# EAGLE design Whale_Lamp-jlc-v2 (EAGLE 8.3.1)
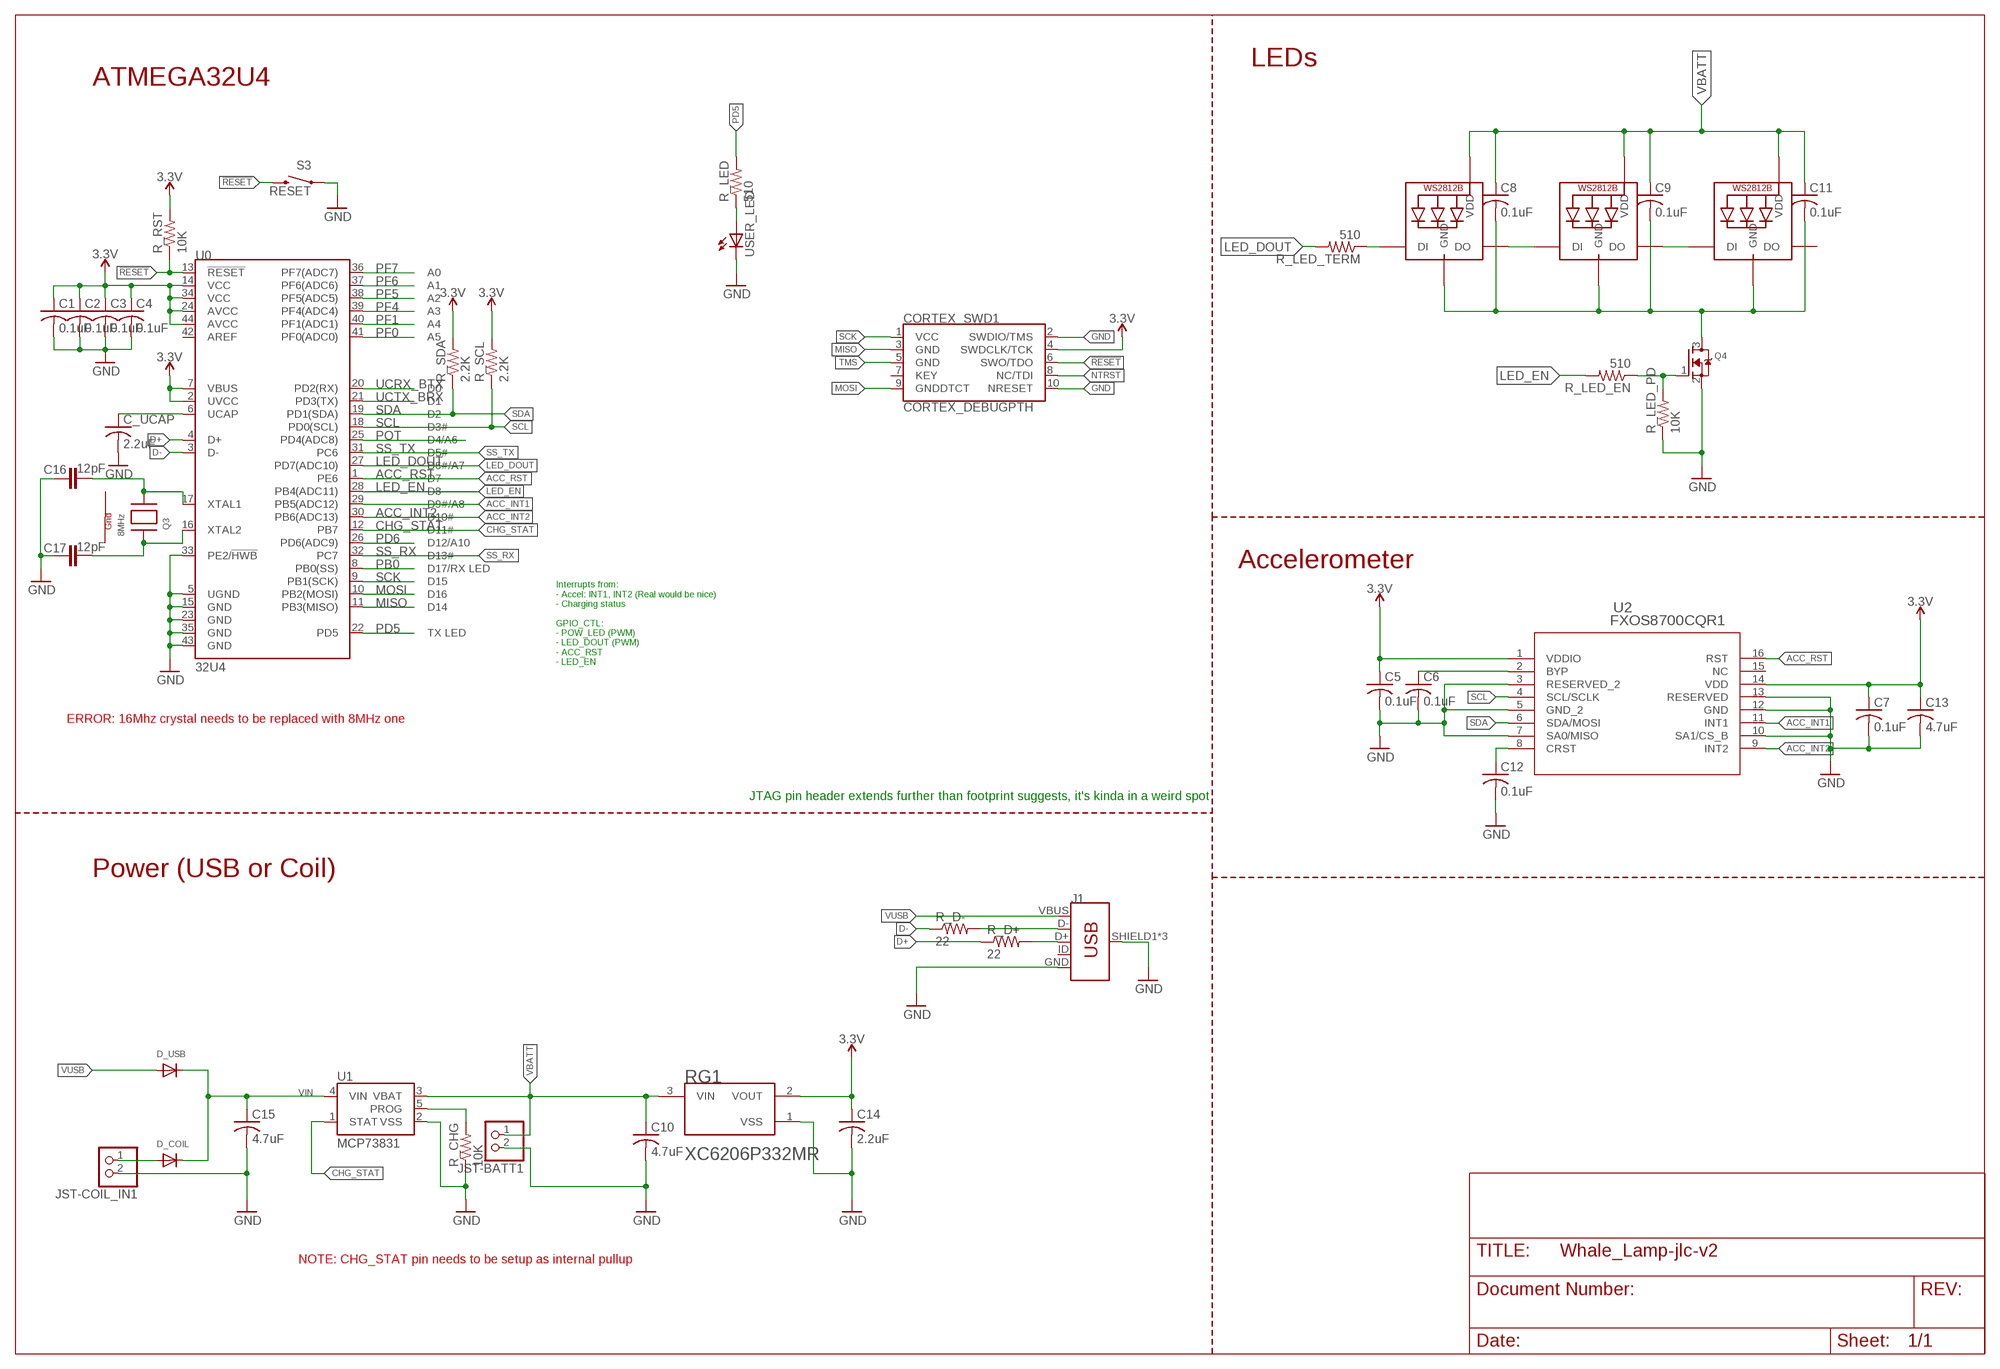
[diagram p0: schematic, sheet 1]

## Parts
C1  0.1uF  C-USC0402  [C0402]
C2  0.1uF  C-USC0402  [C0402]
C3  0.1uF  C-USC0402  [C0402]
C4  0.1uF  C-USC0402  [C0402]
C5  0.1uF  C-USC0402  [C0402]
C6  0.1uF  C-USC0402  [C0402]
C7  0.1uF  C-USC0402  [C0402]
C8  0.1uF  C-USC0402  [C0402]
C9  0.1uF  C-USC0402  [C0402]
C10  4.7uF  C-USC0603  [C0603]
C11  0.1uF  C-USC0402  [C0402]
C12  0.1uF  C-USC0402  [C0402]
C13  4.7uF  C-USC0603  [C0603]
C14  2.2uF  C-USC0603  [C0603]
C15  4.7uF  C-USC0603  [C0603]
C16  12pF  CAP0402-CAP  [0402-CAP]
C17  12pF  CAP0402-CAP  [0402-CAP]
C_UCAP  2.2uF  C-USC0603  [C0603]
CORTEX_SWD1  CORTEX_DEBUGPTH  [2X5-PTH-1.27MM]
D_COIL  DIODESOD-123  [SOD-123]
D_USB  DIODESOD-123  [SOD-123]
J1  USB_MICRO-B_FEMALE-SMT  [USB-B-MICRO-SMD]
JST-BATT1  JST_2PIN-THM-RA  [JST-PH-2-THM-RA]
JST-COIL_IN1  JST_2PIN-THM-RA  [JST-PH-2-THM-RA]
LED1  WS2812B3535  [LED3535]
LED2  WS2812B3535  [LED3535]
LED3  WS2812B3535  [LED3535]
Q3  8MHz  XTAL-4-3225  [NX3225]
Q4  MOSFET-NREFLOW  [SOT23]
R_CHG  10K  R-US_R0402  [R0402]
R_D+  22  R-US_R0402  [R0402]
R_D-  22  R-US_R0402  [R0402]
R_LED  510  R-US_R0402  [R0402]
R_LED_EN  510  R-US_R0402  [R0402]
R_LED_PD  10K  R-US_R0402  [R0402]
R_LED_TERM  510  R-US_R0402  [R0402]
R_RST  10K  R-US_R0402  [R0402]
R_SCL  2.2K  R-US_R0402  [R0402]
R_SDA  2.2K  R-US_R0402  [R0402]
RG1  TOREX_XC6206P332MRTOREX_XC6206P332MR_0_0  [TOREX_XC6206P332MR_0]
S3  RESET  SWITCH-MOMENTARY-2SMD-4.6X2.8MM  [TACTILE_SWITCH_SMD_4.6X2.8MM]
U0  32U4  ATMEGA32U4QFN  [QFN-44]
U1  MCP73831  [SOT23-5]
U2  FXOS8700CQR1  [QFN16_3X3_NXP]
USER_LED  LEDCHIPLED_0603  [CHIPLED_0603]

## Nets
3.3V: C1.1 C2.1 C3.1 C4.1 C5.1 C7.1 C13.1 C14.1 CORTEX_SWD1.4(SWDCLK/TCK) R_RST.2 R_SCL.2 R_SDA.2 RG1.2(VOUT) U0.2(UVCC) U0.7(VBUS) U0.14(VCC) U0.24(AVCC) U0.34(VCC) U0.44(AVCC) U2.1(VDDIO) U2.14(VDD)
!RESET: CORTEX_SWD1.6(SWO/TDO) R_RST.1 S3.3 S3.4 U0.13(!RESET)
ACC_INT1: U0.29(PB5(ADC12)) U2.11(INT1)
ACC_INT2: U0.30(PB6(ADC13)) U2.9(INT2)
ACC_RST: U0.1(PE6) U2.16(RST)
CHG_STAT: U0.12(PB7) U1.1(STAT)
D+: R_D+.1 U0.4(D+)
D-: R_D-.1 U0.3(D-)
GND: C1.2 C2.2 C3.2 C4.2 C5.2 C6.2 C7.2 C10.2 C12.2 C13.2 C14.2 C15.2 C16.1 C17.1 C_UCAP.2 CORTEX_SWD1.2(SWDIO/TMS) CORTEX_SWD1.10(NRESET) J1.GND J1.SHIELD1(SHIELD) J1.SHIELD2(SHIELD) J1.SHIELD3(SHIELD) JST-BATT1.2 JST-COIL_IN1.2 Q4.2(S) R_CHG.1 R_LED_PD.1 RG1.1(VSS) S3.1 S3.2 U0.5(UGND) U0.15(GND) U0.23(GND) U0.33(PE2/!HWB) U0.35(GND) U0.43(GND) U1.2(VSS) U2.3(RESERVED_2) U2.5(GND_2) U2.7(SA0/MISO) U2.10(SA1/CS_B) U2.12(GND) U2.13(RESERVED) USER_LED.C
LED_DOUT: R_LED_TERM.2 U0.27(PD7(ADC10))
LED_EN: R_LED_EN.2 U0.28(PB4(ADC11))
MISO: CORTEX_SWD1.3(GND) U0.11(PB3(MISO))
MOSI: CORTEX_SWD1.9(GNDDTCT) U0.10(PB2(MOSI))
N$6: J1.D- R_D-.2
N$7: R_CHG.2 U1.5(PROG)
N$8: R_LED.1 USER_LED.A
N$10: C16.2 Q3.3(X2) U0.17(XTAL1)
N$11: C17.2 Q3.1(X1) U0.16(XTAL2)
N$12: LED1.3(DO) LED2.1(DI)
N$13: LED2.3(DO) LED3.1(DI)
N$15: C8.2 C9.2 C11.2 LED1.4(GND) LED2.4(GND) LED3.4(GND) Q4.3(D)
N$16: LED1.1(DI) R_LED_TERM.1
N$17: Q4.1(G) R_LED_EN.1 R_LED_PD.2
N$18: C12.1 U2.8(CRST)
N$19: C6.1 U2.2(BYP)
N$21: C_UCAP.1 U0.6(UCAP)
N$23: J1.D+ R_D+.2
N$25: D_COIL.A JST-COIL_IN1.1
NTRST: CORTEX_SWD1.8(NC/TDI)
PB0: U0.8(PB0(SS))
PD5: R_LED.2 U0.22(PD5)
PD6: U0.26(PD6(ADC9))
PF0: U0.41(PF0(ADC0))
PF1: U0.40(PF1(ADC1))
PF4: U0.39(PF4(ADC4))
PF5: U0.38(PF5(ADC5))
PF6: U0.37(PF6(ADC6))
PF7: U0.36(PF7(ADC7))
POT: U0.25(PD4(ADC8))
SCK: CORTEX_SWD1.1(VCC) U0.9(PB1(SCK))
SCL: R_SCL.1 U0.18(PD0(SCL)) U2.4(SCL/SCLK)
SDA: R_SDA.1 U0.19(PD1(SDA)) U2.6(SDA/MOSI)
SS_RX: U0.32(PC7)
SS_TX: U0.31(PC6)
TMS: CORTEX_SWD1.5(GND)
UCRX_BTX: U0.20(PD2(RX))
UCTX_BRX: U0.21(PD3(TX))
VBATT: C8.1 C9.1 C10.1 C11.1 JST-BATT1.1 LED1.2(VDD) LED2.2(VDD) LED3.2(VDD) RG1.3(VIN) U1.3(VBAT)
VIN: C15.1 D_COIL.C D_USB.C U1.4(VIN)
VUSB: D_USB.A J1.VBUS
Unconnected: CORTEX_SWD1.7(KEY) J1.ID LED3.3(DO) U0.42(AREF) U2.15(NC)

## Notes on the sheet
- ATMEGA32U4 | LEDs
- Accelerometer
- Interrupts from:
  - Accel: INT1, INT2 (Real would be nice)
  - Charging status
  
  GPIO_CTL:
  - POW_LED (PWM)
  - LED_DOUT (PWM)
  - ACC_RST 
  - LED_EN
- ERROR: 16Mhz crystal needs to be replaced with 8MHz one
- JTAG pin header extends further than footprint suggests, it's kinda in a weird spot
- Power (USB or Coil)
- NOTE: CHG_STAT pin needs to be setup as internal pullup

## Power pins joined to a net without a drawn wire
G1: Q3.4(G1)
G2: Q3.2(G2)

## Library data of the parts
C1-C15 C_UCAP = adafruit:C-US: CAPACITOR, American symbol
C16 C17 = SparkFun:CAP: Capacitor Standard 0603 ceramic capacitor, and 0.1" leaded capacitor.
CORTEX_SWD1 = samd21-temp:CORTEX_DEBUG: Cortex Debug Connector Datasheet <http://infocenter.arm.com/help/topic/com.arm.doc.faqs/attached/13634/cortex_debug_connectors.pdf>
D_COIL D_USB = adafruit:DIODE: Diode SMADIODE - SMA Surface Mount Package 20V 1A Schottky Diode Digikey: 641-1014-6-ND DO-1N4148 - Through Hole Small Current Diode SOD-123 20V 1 A (.5mV Vf) Schottky Diode - Digikey: MBRX120TPMSCT-ND SOD-323 10V 570mA (.38mV Vf, 3ns) Schottky Diode - Digikey: ZLLS410CT-ND SOD-523 30V 30mA Schottky Diode (RB751S-40TE61) - Digikey: RB751S-40TE61CT-ND SOT23-R/W - SOT23 Package (R = Solder Paste/Reflow Ovens, W = Hand-Soldering) BAT54Film 40V 300mA - Digikey: 497-7162-1-ND
J1 = SparkFun-Connectors:USB_MICRO-B: USB Type Micro-B Connector Male/female and PTH/SMT variants SparkFun Products: SparkFun microB USB Breakout <https://www.sparkfun.com/products/12035> SparkFun USB microB Plug Breakout <https://www.sparkfun.com/products/10031> SparkFun ESP8266 Thing <https://www.sparkfun.com/products/13231>; PROD_ID: CONN-11752
JST-BATT1 JST-COIL_IN1 = adafruit:JST_2PIN: JST 2-Pin Connectors of various flavors SMT-RA (S2B-PH-SM4) 4UConnector #17311 SMT (B2B-PH-SM4) THM-RA (S2B-PH) THM (B2B-PH)
LED1-LED3 = adafruit:WS2812B
Q3 = adafruit:XTAL-4: Classic 4-pin 3.2 x 2.5mm crystal
Q4 = adafruit:MOSFET-N: N-Channel Mosfet 2N7002E - 60V 260mA SOT23 [Digikey: 2N7002ET1GOSTR-ND] - REEL BSH103 - 30V 850mA SOT23 [Digikey: 568-5013-1-ND]
R_CHG R_D+ R_D- R_LED R_LED_EN R_LED_PD R_LED_TERM R_RST R_SCL R_SDA = adafruit:R-US_: RESISTOR, American symbol
RG1 = Torex - XC6206P332MR:TOREX_XC6206P332MR: Low ESR Cap Compatible Positive Voltage Regulator; ACCURACY: ±2%; CENTROID_NOT_SPECIFIED: No; DATASHEET: https://www.torexsemi.com/file/xc6206/XC6206.pdf; DROPOUT_VOLTAGE: 250mV; IMPORTED_FROM: octopart; IPC_LAND_PATTERN_NAME: SOT95P280X110-3; LEAD_FREE: yes; MAXIMUM_OUTPUT_CURRENT: 200mA; MF: Torex; MFG_PACKAGE_IDENT: https://www.torexsemi.com/file/SOT-23/SOT-23-pkg.pdf; MOUSER_PART_NUMBER: 865-XC6206P332MR-G; MPN: XC6206P332MR; NUM_PINS: 3; OCTOPART_PART_NUMBER: e32b2b70e2ce3cec; PACKAGE: SOT23; PREFIX: RG; ROHS: yes; TEMPERATURE_RANGE_HIGH: +85°C; TEMPERATURE_RANGE_LOW: -40°C; VOLTAGE: 3.3V
S3 = samd21-temp:SWITCH-MOMENTARY-2: Various NO switches- pushbuttons, reed, etc; PROD_ID: SWCH-13065
U0 = SparkFun-IC-Microcontroller:ATMEGA32U4: Atmel MCU, 32KByte Atmel 44-pin 8-bit Microcontroller with 32KBytes of ISP Flash and USB Controller Datasheet <http://cdn.sparkfun.com/datasheets/Dev/Arduino/Boards/ATMega32U4.pdf> SparkFun Products LilyPad Arduino USB - ATmega32U4 Board <https://www.sparkfun.com/products/12049> (DEV-12049) Pro Micro - 5V/16MHz <https://www.sparkfun.com/products/12640> (DEV-12640) Pro Micro - 3.3V/8MHz <https://www.sparkfun.com/products/12587> (DEV-12587) Fio v3 - ATmega32U4 <https://www.sparkfun.com/products/11520> (DEV-11520) Qduino Mini <https://www.sparkfun.com/products/13614> (DEV-13614) Makey Makey - Standard Kit <https://www.sparkfun.com/products/11511> (WIG-11511) Makey Makey Deluxe Kit <https://www.sparkfun.com/products/11519> (WIG-11519); PROD_ID: IC-10828
U1 = SparkFun-IC-Power:MCP73831: MCP73831T Li-Ion, Li-Pol Controller Miniature single cell, fully integrated Li-Ion, Li-polymer charge management controller Datasheet <http://ww1.microchip.com/downloads/en/DeviceDoc/20001984g.pdf> SparkFun Products: SparkFun ESP32 Thing <https://www.sparkfun.com/products/13907> SparkFun 9DoF Razor IMU M0 <https://www.sparkfun.com/products/14001>; PROD_ID: IC-09995
U2 = FXOS8700CQR1:FXOS8700CQR1; BUILT_BY: EMA_Jessica; COPYRIGHT: Copyright (C) 2018 Accelerated Designs. All rights reserved; MANUFACTURER_PART_NUMBER: FXOS8700CQR1; SOURCELIBRARY: NXP_2019-12-31; VENDOR: NXP
USER_LED = adafruit:LED: LED OSRAM: - CHIPLED LG R971, LG N971, LY N971, LG Q971, LY Q971, LO R971, LY R971 LH N974, LH R974 LS Q976, LO Q976, LY Q976 LO Q996 - Hyper CHIPLED LW Q18S LB Q993, LB Q99A, LB R99A - SideLED LS A670, LO A670, LY A670, LG A670, LP A670 LB A673, LV A673, LT A673, LW A673 LH A674 LY A675 LS A676, LA A676, LO A676, LY A676, LW A676 LS A679, LY A679, LG A679 - Hyper Micro SIDELED® LS Y876, LA Y876, LO Y876, LY Y876 LT Y87S - SmartLED LW L88C, LW L88S LB L89C, LB L89S, LG L890 LS L89K, LO L89K, LY L89K LS L896, LA L896, LO L896, LY L896 - TOPLED LS T670, LO T670, LY T670, LG T670, LP T670 LSG T670, LSP T670, LSY T670, LOP T670, LYG T670 LG T671, LOG T671, LSG T671 LB T673, LV T673, LT T673, LW T673 LH T674 LS T676, LA T676, LO T676, LY T676, LB T676, LH T676, LSB T676, LW T676 LB T67C, LV T67C, LT T67C, LS T67K, LO T67K, LY T67K, LW E67C LS E67B, LA E67B, LO E67B, LY E67B, LB E67C, LV E67C, LT E67C LW T67C LS T679, LY T679, LG T679 LS T770, LO T770, LY T770, LG T770, LP T770 LB T773, LV T773, LT T773, LW T773 LH T774 LS E675, LA E675, LY E675, LS T675 LS T776, LA T776, LO T776, LY T776, LB T776 LHGB T686 LT T68C, LB T68C - Hyper Mini TOPLED® LB M676 - Mini TOPLED Santana® LG M470 LS M47K, LO M47K, LY M47K Source: http://www.osram.convergy.de/

## Board
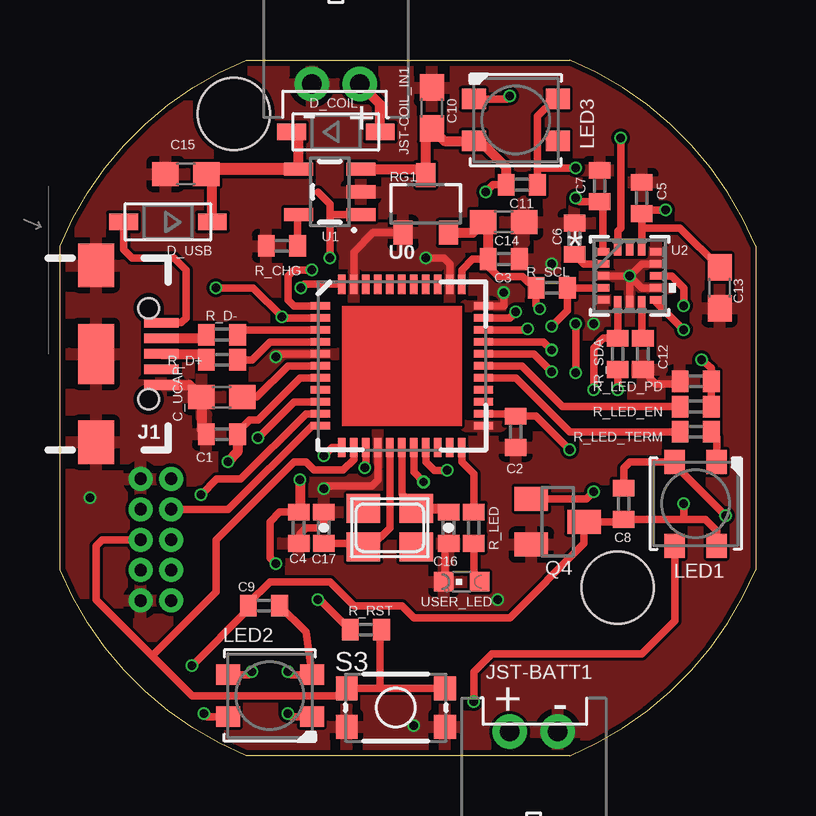
[diagram p1: board, top side]
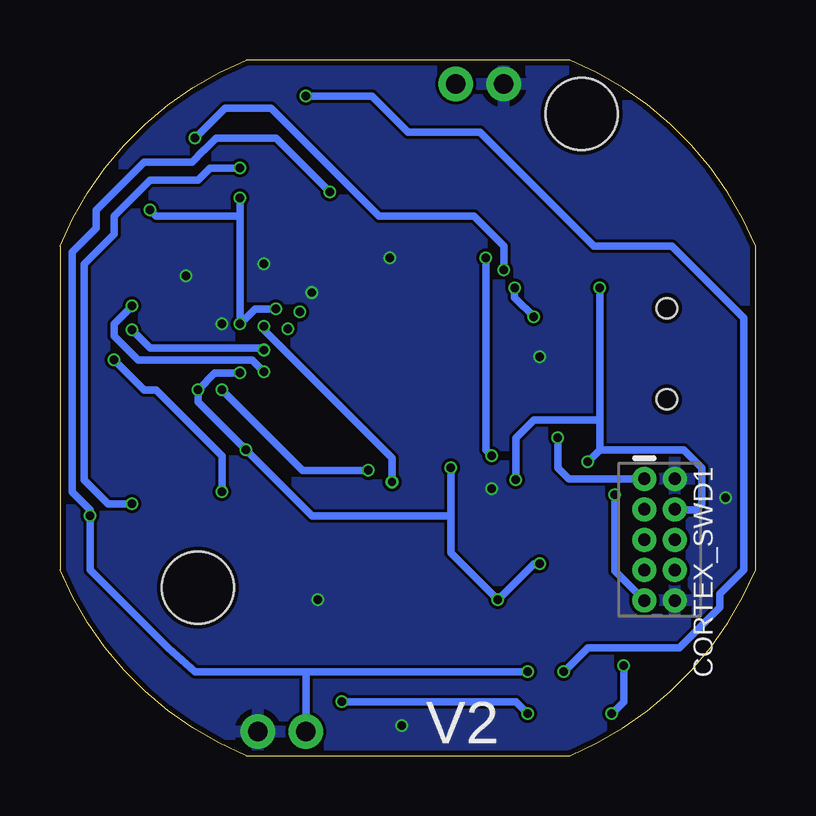
[diagram p2: board, bottom side, seen from below]

Size 29 x 29 mm. Coordinates in mm from the lower left corner, seen from the top.
Outline: 7.75,29 21.25,29 arc-45 29,21.25 29,7.75 arc-45 21.25,0 7.75,0 arc-45 0,7.75 0,21.25 arc-45 7.75,29
Copper layers (1*16): Top 0.035559375mm / dielectric 1.6mm / Bottom 0.035559375mm
Design rules "jlcpcb2layer": minimum track width 5mil, minimum drill 12mil, track to track 5mil, track to pad 5mil, pad to pad 5mil, via to via 5mil, smd to smd 5mil, copper to edge 8mil, drill to drill 6mil, minimum pad ring 5mil, minimum via ring 3mil, stop-mask expansion 2.5mil, vias tented up to drill 0mil, thermal gap 10mil
Holes 3 mm at 23.25,7 7.25,26.75

### Footprints (pad centres in the part's own frame; a part is rotated, then mirrored left to right if it is on the bottom)
C0402 = smd 0.7 x 0.9: 1 -0.65,0; 2 0.65,0
C0603 = smd 1.1 x 1: 1 -0.85,0; 2 0.85,0
0402-CAP = smd 0.7 x 0.9: 1 -0.65,0; 2 0.65,0
2X5-PTH-1.27MM = drill 0.508 pad 1: 1 -2.54,-0.635; 2 -2.54,0.635; 3 -1.27,-0.635; 4 -1.27,0.635; 5 0,-0.635; 6 0,0.635; 7 1.27,-0.635; 8 1.27,0.635; 9 2.54,-0.635; 10 2.54,0.635
SOD-123 = smd 1.2 x 0.7: A 1.85,0; C -1.85,0
USB-B-MICRO-SMD = smd 1.45 x 0.4: D+ 2.725,0; D- 2.725,0.65; GND 2.725,-1.3; ID 2.725,-0.65; VBUS 2.725,1.3 | smd 1.5 x 1.8: SHIELD1 0,3.685; SHIELD2 0,-3.685 | smd 1.5 x 2.5: SHIELD3 0,0 | hole 0.85: 2.2,1.9; 2.2,-1.9
JST-PH-2-THM-RA = drill 0.8 pad 1.422: 1 1,0; 2 -1,0
LED3535 = smd 1 x 0.85: 1 -1.75,0.875; 2 -1.75,-0.875; 3 1.75,-0.875; 4 1.75,0.875
NX3225 = smd 1.4 x 1.2: 1 -1.1,-0.8; 2 1.1,-0.8; 3 1.1,0.8; 4 -1.1,0.8
SOT23 = smd 1 x 1.4: 1 -0.95,-1.1; 2 0.95,-1.1; 3 0,1.1
R0402 = smd 0.7 x 0.9: 1 -0.65,0; 2 0.65,0
TOREX_XC6206P332MR_0 = smd 1 x 0.8: 1 -1.2,0.95; 2 -1.2,-0.95; 3 1.2,0
TACTILE_SWITCH_SMD_4.6X2.8MM = smd 0.9 x 1: 1 -2.05,-0.8; 2 2.05,-0.8; 3 2.05,0.8; 4 -2.05,0.8
QFN-44 = smd 0.8 x 0.3: 1 -3.4,2.5; 2 -3.4,2; 3 -3.4,1.5; 4 -3.4,1; 5 -3.4,0.5; 6 -3.4,0; 7 -3.4,-0.5; 8 -3.4,-1; 9 -3.4,-1.5; 10 -3.4,-2; 11 -3.4,-2.5; 23 3.4,-2.5; 24 3.4,-2; 25 3.4,-1.5; 26 3.4,-1; 27 3.4,-0.5; 28 3.4,0; 29 3.4,0.5; 30 3.4,1; 31 3.4,1.5; 32 3.4,2; 33 3.4,2.5 | smd 0.3 x 0.8: 12 -2.5,-3.4; 13 -2,-3.4; 14 -1.5,-3.4; 15 -1,-3.4; 16 -0.5,-3.4; 17 0,-3.4; 18 0.5,-3.4; 19 1,-3.4; 20 1.5,-3.4; 21 2,-3.4; 22 2.5,-3.4; 34 2.5,3.4; 35 2,3.4; 36 1.5,3.4; 37 1,3.4; 38 0.5,3.4; 39 0,3.4; 40 -0.5,3.4; 41 -1,3.4; 42 -1.5,3.4; 43 -2,3.4; 44 -2.5,3.4
SOT23-5 = smd 0.55 x 1.2: 1 -0.95,-1.3; 2 0,-1.3; 3 0.95,-1.3; 4 0.95,1.3; 5 -0.95,1.3
QFN16_3X3_NXP = smd 0.559 x 0.305: 1 -1.118,1; 2 -1.118,0.5; 3 -1.118,0; 4 -1.118,-0.5; 5 -1.118,-1; 9 1.118,-1; 10 1.118,-0.5; 11 1.118,0; 12 1.118,0.5; 13 1.118,1 | smd 0.305 x 0.559: 6 -0.5,-1.118; 7 0,-1.118; 8 0.5,-1.118; 14 0.5,1.118; 15 0,1.118; 16 -0.5,1.118
CHIPLED_0603 = smd 0.8 x 0.8: A 0,-0.75; C 0,0.75

### Placement (x,y rotation side)
C1  6.75,13.4 180 top
C2  19,13.5 270 top
C3  18.5,20.7 0 top
C4  9.95,9.5 270 top
C5  24.25,23.25 90 top
C6  21.45,21.55 90 top
C7  22.5,23.75 90 top
C8  23.5,10.5 270 top
C9  8.5,6.25 180 top
C10  15.5,27 90 top
C11  19.25,23.8 0 top
C12  24.3,16.75 270 top
C13  27.5,19.5 270 top
C14  18.5,22.25 0 top
C15  5.25,24.25 180 top
C16  16.2,9.5 90 top
C17  11,9.5 270 top
C_UCAP  6.75,14.95 180 top
CORTEX_SWD1  4,9 270 bottom
D_COIL  11.5,26 0 top
D_USB  4.5,22.25 180 top
J1  1.5,16.75 0 top
JST-BATT1  19.75,1 180 top
JST-COIL_IN1  11.5,28 0 top
LED1  26.5,10.5 270 top
LED2  8.75,2.5 180 top
LED3  19,26.5 0 top
Q3  13.75,9.5 0 top
Q4  20.75,9.75 270 top
R_CHG  9.25,21.25 0 top
R_D+  6.75,16.5 180 top
R_D-  6.75,17.55 180 top
R_LED  17.25,9.5 90 top
R_LED_EN  26.5,14.55 180 top
R_LED_PD  26.5,15.6 0 top
R_LED_TERM  26.5,13.5 180 top
R_RST  12.75,5.25 180 top
R_SCL  20.5,19.5 180 top
R_SDA  23.25,16.75 270 top
RG1  15.25,23 90 top
S3  14,2 0 top
U0  14.25,16.25 0 top
U1  11.25,23.5 90 top
U2  23.75,20 0 top
USER_LED  16.75,7.25 90 top

### Tracks (layer width: path | path; a pad name or v marks a point on that pad's centre or on a via)
3.3V  (via drill 0.35)
  Top 0.305: U0.24 18.9,14.25 C2.1 19.85,14.15 v21.25,12.75 | U2.14 24.25,22 | 24.25,22 C5.1 24.4,22.75 v25.25,22.75 | U2.1 22.63,22.97 C7.1 21.65,23.1 v21.5,23.25 | 24.25,22 25.85,22 C13.1 | U0.7 10,15.75 8.25,14 7.9,14 7.4,13.5 C1.1 | C4.1 9.93,10.15 9.15,10.15 8.75,9.75 8.75,8.25 v9,8 | v10.75,6.5 10.85,6.5 R_RST.2 | U0.2 9.29,18.25 v9.25,18.29 | U0.44 10.19,19.65 v10.04,19.5 | U0.14 12.75,12.04 v12.71,12 | R_SDA.2 v23.25,15.25 | v20,18.62 19.85,18.77 R_SCL.2 19.6,19.75 19.5,19.75 19.28,19.97 18.28,19.97 17.85,20.4 C3.1 17.2,20.7 16.75,20.25 U0.34 | v21.5,18 v21.5,15.96 | v9.25,18.29 9.21,18.29 | v6.5,19.5 8.04,19.5 v9.25,18.29
  Top 0.406: RG1.2 17.2,21.8 C14.1 17.85,22.05 C3.1 | v10,11.5 10,10.22 9.93,10.15 | C1.1 7.4,12.65 v7,12.25
  Bottom 0.305: 6.5,12.75 3,12.75 2.25,12 2.25,10.5 2.5,10.25 3.35,10.25 CORTEX_SWD1.4 | v7,12.25 6.5,12.75 | v10,11.5 10,13.25 9.25,14 6.51,14 6.5,14.01 | v9,8 9.25,8 v10.75,6.5 12.71,8.46 12.71,10 | v10.04,19.5 10.04,19.08 v9.25,18.29 | v12.71,12 12.71,10 | v20,18.62 20.88,18.62 v21.5,18 21.5,22.5 | v21.5,15.96 22.54,15.96 v23.25,15.25 23.25,14.75 v21.25,12.75 18.5,10 12.71,10 | v21.5,23.25 21.5,22.5 | 21.5,22.5 25,22.5 v25.25,22.75 | 6.5,14.01 v6.5,19.5 | 6.5,14.01 6.5,12.75
!RESET
  Top 0.305: 13.3,2.8 S3.3 | 13.3,2.8 S3.4 11.65,2.5 5.5,2.5 3.84,4.16 | 13.3,2.8 13.35,2.85 13.35,5.2 R_RST.1 | 3.84,4.16 1.5,6.5 1.5,8.75 1.75,9 CORTEX_SWD1.6 | 3.84,4.16 6.5,6.82 6.5,9 9.75,12.25 10.25,12.25 10.6,11.9 11.8,11.9 12.25,12.35 U0.13
ACC_INT1  (via drill 0.35)
  Top 0.305: U2.11 25.5,20 26,19.5 v26,18.75 | U0.29 19.75,16.75 v20.5,16
  Bottom 0.305: v26,18.75 26.75,18 26.75,17.5 25.75,16.5 21,16.5 v20.5,16
ACC_INT2  (via drill 0.35)
  Top 0.305: U2.9 24.87,18.88 v26,17.75 | U0.30 20.16,17.25 v20.5,16.91
  Bottom 0.305: v20.5,16.91 20.59,17 25.25,17 v26,17.75
ACC_RST  (via drill 0.35)
  Top 0.305: U0.1 9.75,18.75 9.5,19 9.5,20 9.75,20.25 v10.5,20.25 | U2.16 23.25,21.88 23.38,22 v23.38,25.75
  Bottom 0.305: v10.5,20.25 10.5,21.25 11.75,22.5 15.7,22.5 20.2,27 22.12,27 v23.38,25.75
CHG_STAT  (via drill 0.35)
  Top 0.305: 12.19,22.55 U1.1 | 12.5,22.5 U1.1 | 11.25,22.49 v11.25,20.75 | 11.25,22.49 11.25,23 10.75,23.5 | U1.1 11.31,22.55 11.25,22.49 | U0.12 11.35,12.85 v11,12.5
  Bottom 0.305: v11.25,20.75 11.25,12.75 v11,12.5
D+
  Top 0.305: U0.4 8.75,17.25 8,16.5 R_D+.1
D-
  Top 0.305: R_D-.1 7.6,17.75 U0.3
GND  (via drill 0.35)
  Top 0.305: U2.12 24.25,20.5 v23.75,20 | U0.5 9.12,16.75 v9,16.62 | U2.3 v23.75,20 | U2.7 v23.75,20 | U0.35 16.25,20.5 16,20.75 v15.25,20.75 | U0.33 18.5,18.75 v18.5,19.3 | C4.2 10,9.25 10.25,9.5 10.75,9.5 11,9.75 C17.1 | RG1.1 13.05,21.8 12.25,21 U0.43 | 25.7,15.5 R_LED_PD.1 25.75,15.5 24.85,15.5 24.3,16.05 C12.2 | U2.10 24.25,19.5 v23.75,20 | U0.15 13.25,11.5 13,11.25 11.12,11.25 v11,11.12 | 16.05,8.7 16.05,7.3 USER_LED.C
  Top 0.406: C1.2 5.9,13.6 C_UCAP.2 5.4,15.45 J1.GND | C16.1 16.05,8.7
  other vias: 14.75,1.25 18.25,6.5 22.25,18 1.25,10.75 20.5,20.5
  pour Top: -8.5,39.5 44,39.5 44,-11 -8.5,-11
  pour Bottom: -12,46 49,46 49,-16.5 -12,-16.5
LED_DOUT
  Top 0.305: U0.27 19,15.75 21.25,13.5 R_LED_TERM.2
LED_EN
  Top 0.305: U0.28 19.25,16.25 20.95,14.55 R_LED_EN.2
MISO
  Top 0.305: U0.11 10.5,13.75 7.02,10.27 CORTEX_SWD1.3
MOSI  (via drill 0.35)
  Top 0.305: U0.10 10.25,14.25 7.54,11.54 6.54,11.54 v5.88,10.88
  Bottom 0.305: v5.88,10.88 5.88,7.7 CORTEX_SWD1.9
N$6
  Top 0.406: J1.D- 5.95,17.4 R_D-.2
N$7
  Top 0.305: R_CHG.2 9.9,22.5 U1.5
N$8
  Top 0.305: R_LED.1 17.25,7.5 USER_LED.A
N$10
  Top 0.305: U0.17 14.25,10.9 Q3.3
  Top 0.406: Q3.3 16.05,10.3 C16.2
N$11
  Top 0.305: U0.16 13.75,9.5 12.95,8.7 Q3.1 12.5,8.85 C17.2
N$12  (via drill 0.35)
  Top 0.305: LED2.1 9.62,1.62 v9.5,1.75 | LED1.3 25.62,5.62 24.25,4.25 18,4.25 17.25,3.5 v17.25,2.25
  Bottom 0.305: v17.25,2.25 10,2.25 v9.5,1.75
N$13  (via drill 0.35)
  Top 0.305: LED2.3 7.88,3.38 v8,3.5 | LED3.1 18.62,27.38 v18.75,27.5
  Bottom 0.305: v18.75,27.5 16,27.5 14.5,26 11.5,26 6.75,21.25 3.5,21.25 0.5,18.25 0.5,7.75 1.5,6.75 1.5,6.18 3.18,4.5 7,4.5 v8,3.5
N$15  (via drill 0.35)
  Top 0.305: 26.02,9.85 26.9,9.85 27.38,9.38 LED1.4 | 26.02,9.85 C8.2 23.4,9.75 Q4.3 21.85,8.85 18.75,5.75 14.75,5.75 14.25,6.25 12.25,6.25 11.25,7.25 8.75,7.25 7.85,6.35 C9.2 7.85,6.1 v5.5,3.75 | LED2.4 6.12,1.62 v6,1.75 | LED3.4 20.62,27.38 19.9,26.65 19.9,24.49 | 19.9,24.49 C11.2 | v26,10.5 26,9.87 26.02,9.85 | v21.5,24.5 19.91,24.5 19.9,24.49
  Bottom 0.305: v26,10.5 27,10.5 28,11.5 28,20.5 26.75,21.75 26.75,22.5 25.25,24 23.25,24 22.75,24.5 v21.5,24.5 | v5.5,3.75 5.5,2.25 v6,1.75
N$16
  Top 0.305: LED1.1 27.38,13.28 R_LED_TERM.1
N$17  (via drill 0.35)
  Top 0.305: R_LED_EN.1 R_LED_PD.2 27.15,16.15 v26.75,16.5 | Q4.1 21.95,10.7 v22.25,11
  Bottom 0.305: v22.25,11 22.25,12.5 25,15.25 25.5,15.25 v26.75,16.5
N$18
  Top 0.305: U2.8 24.25,17.45 C12.1
N$19
  Top 0.305: U2.2 21.85,20.5 C6.1
N$21
  Top 0.305: U0.6 9.5,16.25 8.2,14.95 C_UCAP.1
N$23
  Top 0.406: J1.D+ 5.85,16.75 R_D+.2
N$25
  Top 0.406: D_COIL.A 13.35,27.15 JST-COIL_IN1.1
PD5
  Top 0.305: R_LED.2 17.25,11.75 16.75,12.25 U0.22
SCK  (via drill 0.35)
  Top 0.305: U0.9 9.75,14.75 v8.25,13.25
  Bottom 0.305: CORTEX_SWD1.1 7.79,11.54 8.25,12 v8.25,13.25
SCL  (via drill 0.35)
  Top 0.305: U2.4 R_SCL.1 21.15,18.55 v20.5,17.9 | U0.18 14.75,11.81 v15.16,11.4
  Bottom 0.305: v20.5,17.9 20.5,17.75 15.16,12.41 v15.16,11.4
SDA  (via drill 0.35)
  Top 0.305: U2.6 R_SDA.1 22.65,17.4 22.25,17 v22.25,15.25 | v16.14,11.89 15.61,11.89 15.25,12.25 U0.19
  Bottom 0.305: v16.14,11.89 18.89,11.89 v22.25,15.25
SS_RX  (via drill 0.35)
  Top 0.305: U0.32 18.77,18.25 v19.01,18.49
SS_TX  (via drill 0.35)
  Top 0.305: U0.31 19.46,17.75 v19.5,17.79
VBATT  (via drill 0.35)
  Top 0.305: C9.1 10.25,5.15 LED2.2 9.62,3.38 v9.5,3.5 | C8.1 23.5,12 23.75,12.25 LED1.2 25.62,12.12 v27.75,10 | C11.1 18.05,23.8 v17.75,23.5
  Top 0.406: 15.25,24.32 RG1.3 | 15.25,24.32 15.25,25.9 C10.1 16.02,25.62 LED3.2 17.5,25.62 18.6,24.52 C11.1 | U1.3 15.12,24.45 15.25,24.32
  Bottom 0.305: 18.81,3.5 23.36,3.5 24.5,4.5 27.75,7.75 v27.75,10 27.75,10.25 28.5,11 28.5,21 27.5,22 27.5,22.75 25.5,24.75 23.5,24.75 23.01,25.24 22.99,25.24 22.48,25.75 20,25.75 v17.75,23.5 | 18.81,3.5 v9.5,3.5 | JST-BATT1.1 18.75,3.44 18.81,3.5
VIN
  Top 0.406: D_USB.C 6.35,24 C15.1 6.2,24.15 | U1.4 9.95,25.7 D_COIL.C
  Top 0.508: U1.4 6.3,24.45 C15.1
VUSB
  Top 0.305: J1.VBUS 5.05,18.05 5.25,18.25 5.25,20.25 4.75,20.75 3,20.75 2.65,21.1 D_USB.A

### Text on the board
bPlace: V2